# EAGLE design piZLC1 (EAGLE 9.6.2)
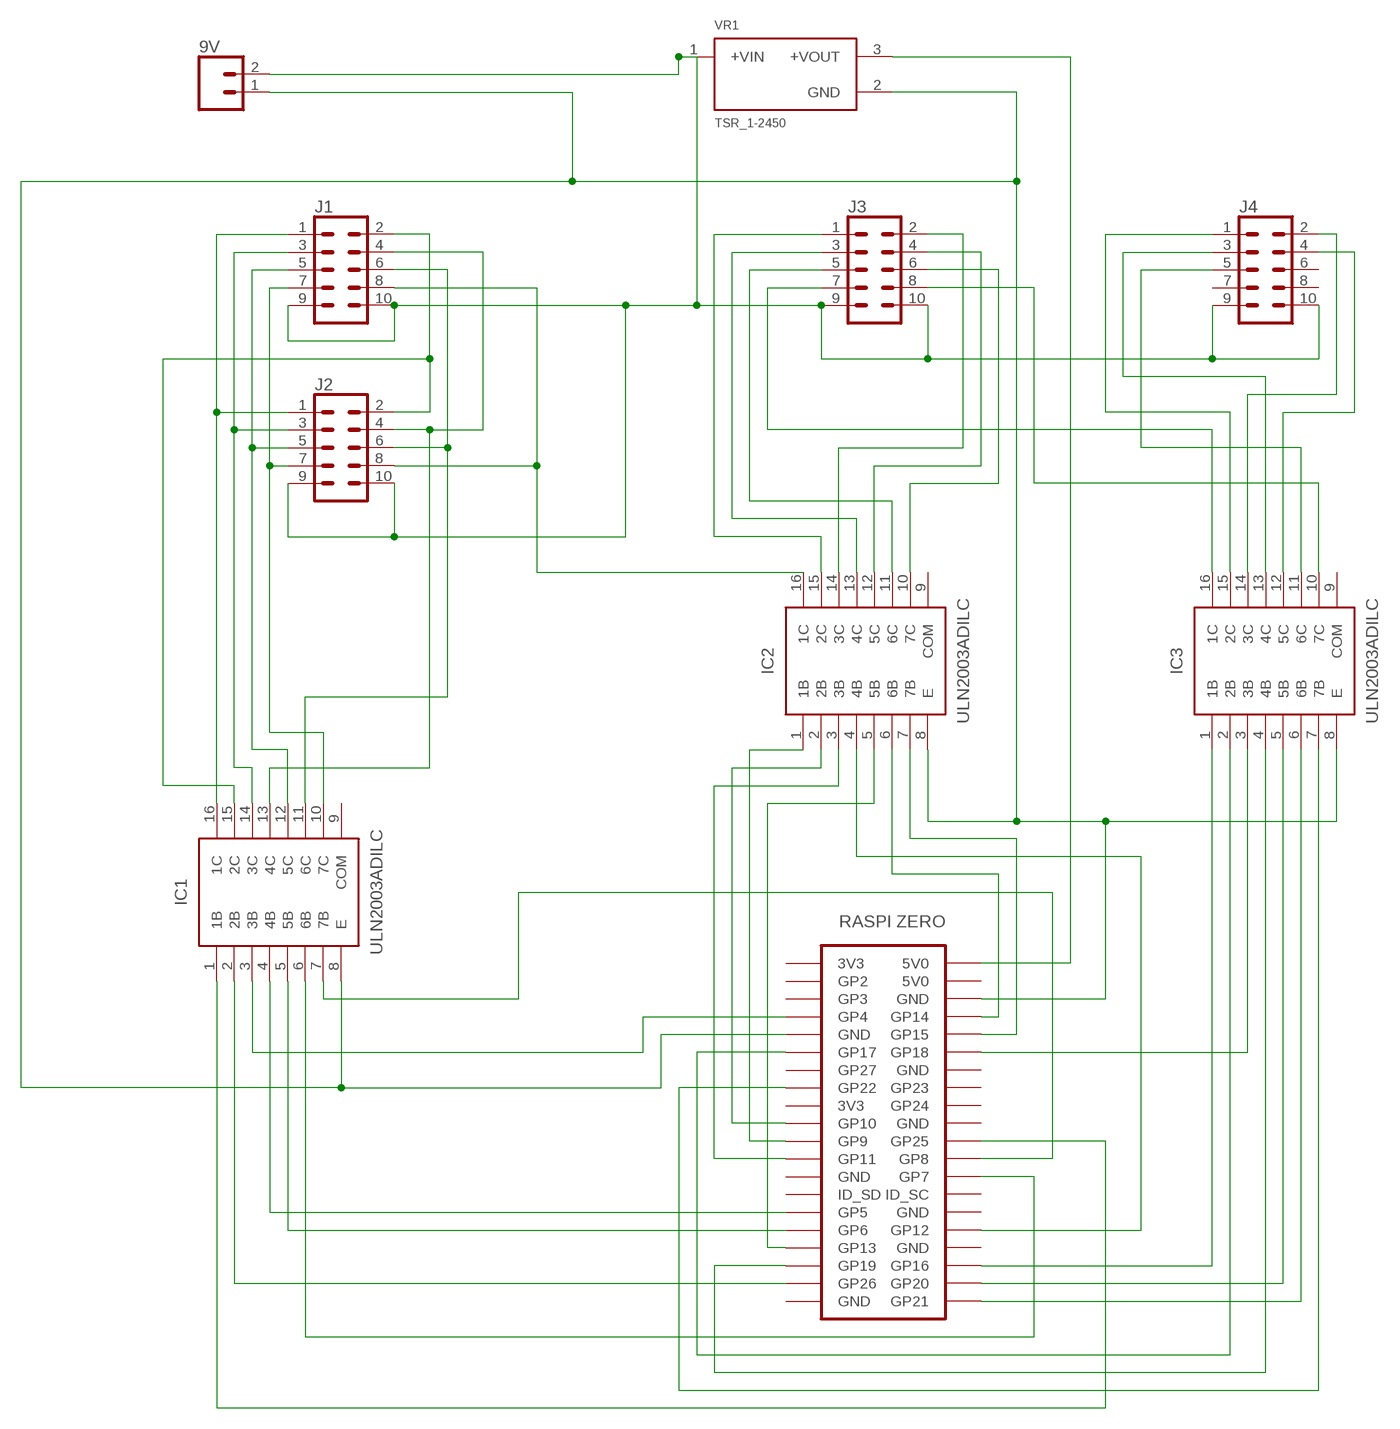
[diagram p0: schematic, sheet 1]

## Parts
9V  CONN_023.5MM  [SCREWTERMINAL-3.5MM-2]
IC1  ULN2003ADILC  [DIL16]
IC2  ULN2003ADILC  [DIL16]
IC3  ULN2003ADILC  [DIL16]
J1  CONN_05X2SHD  [2X5-SHROUDED]
J2  CONN_05X2SHD  [2X5-SHROUDED]
J3  CONN_05X2SHD  [2X5-SHROUDED]
J4  CONN_05X2SHD  [2X5-SHROUDED]
U$1  ZERO  [ZERO]
VR1  TSR_1-2450  [CONV_TSR_1-2450]

## Nets
N$1: U$1.4(5V0) VR1.3(+VOUT)
N$3: IC1.16(1C) J1.1 J2.1
N$4: IC1.14(3C) J1.3 J2.3
N$5: IC1.12(5C) J1.5 J2.5
N$6: IC1.10(7C) J1.7 J2.7
N$8: IC1.1(1B) U$1.22(GP25)
N$9: IC1.2(2B) U$1.37(GP26)
N$10: IC1.3(3B) U$1.7(GP4)
N$11: IC1.4(4B) U$1.29(GP5)
N$12: IC1.5(5B) U$1.31(GP6)
N$13: IC1.6(6B) U$1.26(GP7)
N$14: IC1.7(7B) U$1.24(GP8)
N$15: IC1.15(2C) J1.2 J2.2
N$16: 9V.1 IC1.8(E) IC2.8(E) IC3.8(E) U$1.6(GND) U$1.9(GND) VR1.2(GND)
N$17: IC1.13(4C) J1.4 J2.4
N$18: IC1.11(6C) J1.6 J2.6
N$19: IC2.16(1C) J1.8 J2.8
N$20: IC2.1(1B) U$1.21(GP9)
N$21: IC2.2(2B) U$1.19(GP10)
N$22: IC2.3(3B) U$1.23(GP11)
N$23: IC2.4(4B) U$1.32(GP12)
N$24: IC2.5(5B) U$1.33(GP13)
N$25: IC2.6(6B) U$1.8(GP14)
N$26: IC2.7(7B) U$1.10(GP15)
N$27: IC3.1(1B) U$1.36(GP16)
N$28: IC3.2(2B) U$1.11(GP17)
N$29: IC3.3(3B) U$1.12(GP18)
N$30: IC3.4(4B) U$1.35(GP19)
N$31: IC3.5(5B) U$1.38(GP20)
N$32: IC3.6(6B) U$1.40(GP21)
N$33: IC3.7(7B) U$1.15(GP22)
N$34: IC2.15(2C) J3.1
N$35: IC2.14(3C) J3.2
N$36: IC2.13(4C) J3.3
N$37: IC2.12(5C) J3.4
N$38: IC2.11(6C) J3.5
N$39: IC2.10(7C) J3.6
N$40: IC3.16(1C) J3.7
N$41: IC3.15(2C) J4.1
N$42: IC3.14(3C) J4.2
N$43: IC3.13(4C) J4.3
N$44: IC3.12(5C) J4.4
N$45: IC3.11(6C) J4.5
N$46: IC3.10(7C) J3.8
N$47: 9V.2 J1.9 J1.10 J2.9 J2.10 J3.9 J3.10 J4.9 J4.10 VR1.1(+VIN)
Unconnected: J4.6 J4.7 J4.8 U$1.1(3V3) U$1.2(5V0) U$1.3(GP2) U$1.5(GP3) U$1.13(GP27) U$1.14(GND) U$1.16(GP23) U$1.17(3V3) U$1.18(GP24) U$1.20(GND) U$1.25(GND) U$1.27(ID_SD) U$1.28(ID_SC) U$1.30(GND) U$1.34(GND) U$1.39(GND)

## Power pins joined to a net without a drawn wire
COM: IC1.9(COM) IC2.9(COM) IC3.9(COM)

## Library data of the parts
9V = SparkFun-Connectors:CONN_02: Multi connection point. Often used as Generic Header-pin footprint for 0.1 inch spaced/style header connections On any of the 0.1 inch spaced packages, you can populate with these: Break Away Headers - Straight <https://www.sparkfun.com/products/116> (PRT-00116) Break Away Male Headers - Right Angle <https://www.sparkfun.com/products/553> (PRT-00553) Female Headers <https://www.sparkfun.com/products/115> (PRT-00115) Break Away Headers - Machine Pin <https://www.sparkfun.com/products/117> (PRT-00117) Break Away Female Headers - Swiss Machine Pin <https://www.sparkfun.com/products/743> (PRT-00743) For SCREWTERMINALS and SPRING TERMINALS visit here: Screw Terimnals on SparkFun.com <https://www.sparkfun.com/search/results?term=Screw+Terminals> (5mm/3.5mm/2.54mm spacing) This device is also useful as a general connection point to wire up your design to another part of your project. Our various solder wires solder well into these plated through hole pads. Hook-Up Wire - Assortment (Stranded, 22 AWG) <https://www.sparkfun.com/products/11375> (PRT-11375) Hook-Up Wire - Assortment (Solid Core, 22 AWG) <https://www.sparkfun.com/products/11367> (PRT-11367) View the entire wire category on our website here <https://www.sparkfun.com/categories/141> Special notes: Molex polarized connector foot print use with: PRT-08233 with associated crimp pins and housings. 2.54_SCREWTERM for use with PRT-10571. 3.5mm Screw Terminal footprints for PRT-08084 5mm Screw Terminal footprints for use with PRT-08432; PROD_ID: CONN-08399
IC1-IC3 = TimsZero:ULN2003ADIL: High-Voltage, High-Current Darlington Transistor Arrays 500-mA Rated Collector Current(Single Output) High-Voltage Outputs: 50V Output Clamp Diodes
J1-J4 = SparkFun-Connectors:CONN_05X2: Multi connection point. Often used as Generic Header-pin footprint for 0.1 inch spaced/style header connections For AVR SPI programming port, see special device with nice symbol: "AVR_SPI_PROG_5x2.dev" You can populate with any combo of single row headers, but if you'd like an exact match, check these: 2x5 AVR ICSP Male Header <https://www.sparkfun.com/products/778> (PRT-00778) 2x5 Pin Shrouded Header <https://www.sparkfun.com/products/8506> (PRT-08506) On any of the 0.1 inch spaced packages, you can populate with these: Break Away Headers - Straight <https://www.sparkfun.com/products/116> (PRT-00116) Break Away Male Headers - Right Angle <https://www.sparkfun.com/products/553> (PRT-00553) Female Headers <https://www.sparkfun.com/products/115> (PRT-00115) Break Away Headers - Machine Pin <https://www.sparkfun.com/products/117> (PRT-00117) Break Away Female Headers - Swiss Machine Pin <https://www.sparkfun.com/products/743> (PRT-00743) Special note: the shrouded connector mates well with our 5x2 ribbon cables: 2x5 Pin IDC Ribbon Cable <https://www.sparkfun.com/products/8535> (PRT-08535); PROD_ID: CONN-08671; SF_ID: PRT-08506
U$1 = TimsZero:ZERO: Raspbery Pi Foundation Zero https://www.raspberrypi.org/products/pi-zero/
VR1 = TSR_1-2450:TSR_1-2450: Linear Regulator Replacement DC DC Converter 1 Output 12V 1A 15V - 36V Input; DESCRIPTION: Linear Regulator Replacement DC DC Converter 1 Output 5V 1A 6.5V - 36V Input; DIGI-KEY_PART_NUMBER: 1951-2524-ND; MF: Traco Power; MP: TSR 1-2450; PACKAGE: SIP-3 Tracopower

## Board
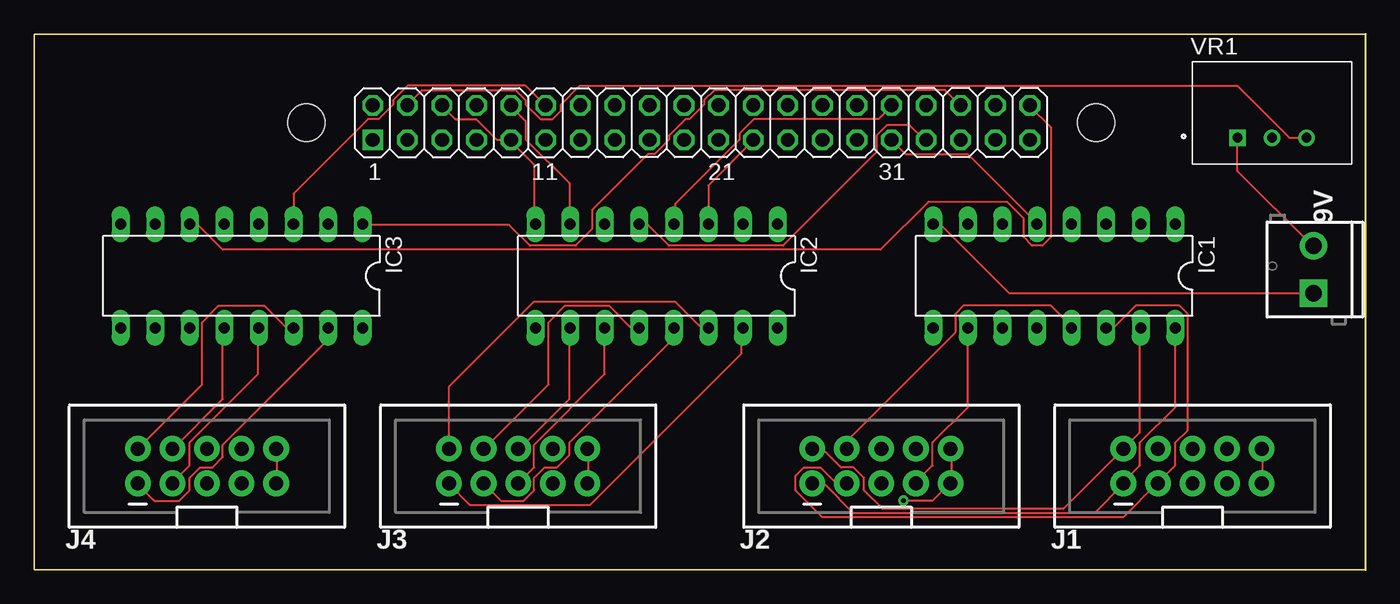
[diagram p1: board, top side]
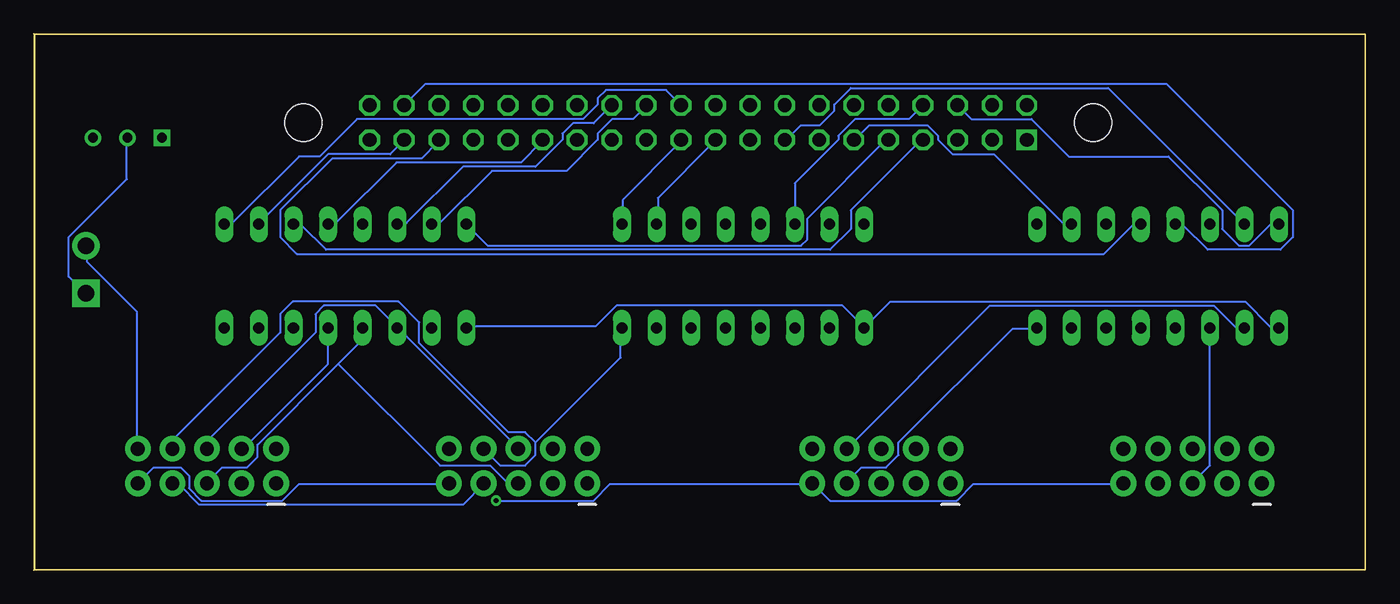
[diagram p2: board, bottom side, seen from below]

Size 97.79 x 39.37 mm. Coordinates in mm from the lower left corner, seen from the top.
Outline: 80.95,0 0,0 0,39.36 80.95,39.36
Outline: 97.79,39.37 97.79,0
Copper layers (1*16): Top 0.035mm / dielectric 1.5mm / Bottom 0.035mm
Design rules "default": minimum track width 6mil, minimum drill 0.35mm, track to track 6mil, track to pad 6mil, pad to pad 6mil, via to via 6mil, smd to smd 6mil, copper to edge 40mil, drill to drill 6mil, minimum pad ring 10mil, minimum via ring 8mil, stop-mask expansion 4mil, vias tented up to drill 0mil, thermal gap 10mil

### Footprints (pad centres in the part's own frame; a part is rotated, then mirrored left to right if it is on the bottom)
SCREWTERMINAL-3.5MM-2 = drill 1.2 pad 2.032 square: 1 0,0 | drill 1.2 pad 2.032: 2 3.5,0
DIL16 = drill 0.813 long: 1 -8.89,-3.81; 2 -6.35,-3.81; 3 -3.81,-3.81; 4 -1.27,-3.81; 5 1.27,-3.81; 6 3.81,-3.81; 7 6.35,-3.81; 8 8.89,-3.81; 9 8.89,3.81; 10 6.35,3.81; 11 3.81,3.81; 12 1.27,3.81; 13 -1.27,3.81; 14 -3.81,3.81; 15 -6.35,3.81; 16 -8.89,3.81
2X5-SHROUDED = drill 1.016 pad 1.88: 1 -1.27,5.08; 2 1.27,5.08; 3 -1.27,2.54; 4 1.27,2.54; 5 -1.27,0; 6 1.27,0; 7 -1.27,-2.54; 8 1.27,-2.54; 9 -1.27,-5.08; 10 1.27,-5.08
ZERO = drill 1.016 square: 1 8.37,25.24 | drill 1.016 octagon: 2 8.37,27.78; 3 10.91,25.24; 4 10.91,27.78; 5 13.45,25.24; 6 13.45,27.78; 7 15.99,25.24; 8 15.99,27.78; 9 18.53,25.24; 10 18.53,27.78; 11 21.07,25.24; 12 21.07,27.78; 13 23.61,25.24; 14 23.61,27.78; 15 26.15,25.24; 16 26.15,27.78; 17 28.69,25.24; 18 28.69,27.78; 19 31.23,25.24; 20 31.23,27.78; 21 33.77,25.24; 22 33.77,27.78; 23 36.31,25.24; 24 36.31,27.78; 25 38.85,25.24; 26 38.85,27.78; 27 41.39,25.24; 28 41.39,27.78; 29 43.93,25.24; 30 43.93,27.78; 31 46.47,25.24; 32 46.47,27.78; 33 49.01,25.24; 34 49.01,27.78; 35 51.55,25.24; 36 51.55,27.78; 37 54.09,25.24; 38 54.09,27.78; 39 56.63,25.24; 40 56.63,27.78 | hole 2.75: 3.5,26.5; 61.5,26.5
CONV_TSR_1-2450 = drill 0.71 pad 1.11 square: 1 -2.54,0 | drill 0.71 pad 1.11: 2 0,0; 3 2.54,0

### Placement (x,y rotation side)
9V  93.98,20.32 90 top
IC1  74.93,21.59 180 top
IC2  45.72,21.59 180 top
IC3  15.24,21.59 180 top
J1  85.09,7.62 90 top
J2  62.23,7.62 90 top
J3  35.56,7.62 90 top
J4  12.7,7.62 90 top
U$1  16.51,6.35 0 top
VR1  90.93,31.75 0 top

### Tracks (layer width: path | path; a pad name or v marks a point on that pad's centre or on a via)
COM
  Bottom 0.152: IC3.9 6.4,17.88 7.01,17.88 8.84,19.71 34.9,19.71 IC2.9 36.88,17.88 38.41,19.41 55.02,19.41 56.54,17.88 65.99,17.88 IC1.9
N$1
  Top 0.152: VR1.3 92.2,31.75 88.39,35.56 40.08,35.56 38.71,34.19 38.71,33.73 38.1,33.12 37.19,33.12 36.12,34.19 36.12,34.49 35.36,35.26 28.5,35.26 27.43,34.19 U$1.4
N$3
  Top 0.152: IC1.16 83.82,11.94 81.23,9.35 81.23,7.67 80.01,6.45 J1.1 80.01,6.3 77.88,4.17 60.2,4.17 58.06,6.3 57.15,6.3 J2.1
N$4
  Top 0.152: IC1.14 78.79,17.88 79.4,17.88 80.92,19.41 84.12,19.41 84.73,18.8 84.73,10.26 83.82,9.35 83.82,7.67 82.6,6.45 J1.3 82.45,6.3 80.01,3.86 57.91,3.86 55.93,5.84 55.93,6.91 56.54,7.52 57.76,7.52 58.83,6.45 59.59,6.45 J2.3
N$5
  Bottom 0.152: 75.44,15.14 81.38,9.19 81.38,8.28 82.14,7.52 83.97,7.52 85.04,6.45 J1.5 | 75.44,15.14 73.76,16.81 73.76,17.73 IC1.12 | 75.44,15.14 67.97,7.67 64.31,7.67 63.09,6.45 62.33,6.45 J2.5
N$6
  Top 0.152: IC1.10 68.58,11.94 65.99,9.35 65.99,7.67 64.77,6.45 J2.7
  Bottom 0.152: J1.7 87.63,6.3 87.17,6.3 85.65,4.78 66.29,4.78 64.77,6.3 J2.7
N$8
  Bottom 0.152: IC1.1 83.82,25.5 83.21,25.5 78.33,30.38 76.81,30.38 74.07,33.12 57.45,33.12 56.39,34.19 56.39,34.65 55.78,35.26 51.36,35.26 50.29,34.19 U$1.22
N$9
  Bottom 0.152: IC1.2 81.23,25.5 76.2,30.53 71.63,30.53 70.71,31.45 U$1.37
N$10
  Bottom 0.152: IC1.3 78.64,25.35 78.18,25.35 76.35,23.52 39.32,23.52 37.8,25.04 37.8,26.42 32.61,31.6 U$1.7
N$11
  Bottom 0.152: IC1.4 76.2,25.5 75.59,25.5 71.17,29.92 62.03,29.92 60.5,31.45 U$1.29
N$12
  Top 0.152: IC1.5 73.61,25.5 68.58,30.53 64.01,30.53 63.09,31.45 U$1.31
N$13
  Bottom 0.152: IC1.6 71.02,25.5 70.41,25.5 66.29,29.62 60.96,29.62 58.98,31.6 58.98,32.05 58.22,32.82 56.69,32.82 55.47,34.04 U$1.26
N$14
  Bottom 0.152: IC1.7 68.58,25.5 67.97,25.5 64.16,29.31 58.67,29.31 56.39,31.6 56.39,32.05 55.32,33.12 53.8,33.12 52.88,34.04 U$1.24
N$15
  Top 0.152: IC1.15 81.23,17.73 81.23,10.11 J1.2 75.59,4.47 62.33,4.47 60.96,5.84 60.96,6.76 60.2,7.52 59.28,7.52 57.91,8.89 J2.2
N$16
  Top 0.152: IC2.8 36.73,25.5 36.73,29.77 35.05,31.45 U$1.9 34.9,31.6 33.98,31.6 32.46,33.12 30.94,33.12 30.02,34.04 U$1.6 | 9V.1 71.63,20.32 66.6,25.35 66.14,25.35 IC1.8
  Bottom 0.152: IC3.8 6.4,25.35 7.01,25.35 8.53,23.83 9.3,23.83 10.52,25.04 10.52,26.42 14.48,30.38 21.79,30.38 24.54,33.12 28.96,33.12 29.87,34.04 U$1.6 | VR1.2 90.98,31.75 90.98,28.7 95.25,24.44 95.25,21.54 94.03,20.32 9V.1 | IC1.8 64.47,23.83 41.45,23.83 41,24.28 41,25.81 35.36,31.45 35.05,31.45 U$1.9
N$17
  Top 0.152: J2.4 59.74,8.89 59.74,9.5 67.67,17.42 67.67,18.8 68.28,19.41 74.68,19.41 76.2,17.88 IC1.13
  Bottom 0.152: IC1.13 76.2,15.14 82.45,8.89 J1.4
N$18
  Bottom 0.152: J2.6 62.18,8.89 71.02,17.73 IC1.11 71.17,17.88 72.69,19.41 76.5,19.41 77.11,18.8 77.11,17.42 85.04,9.5 85.04,8.89 J1.6
N$19
  Bottom 0.152: 60.96,9.35 54.71,15.6 54.71,17.73 IC2.16 | 60.96,9.35 60.96,8.43 61.72,7.67 63.55,7.67 J2.8 | J1.8 87.63,9.5 79.7,17.42 79.7,18.8 78.79,19.71 71.02,19.71 69.49,18.19 69.49,16.66 62.94,10.11 61.72,10.11 60.96,9.35
N$20
  Bottom 0.152: IC2.1 54.56,25.5 54.56,27.18 50.29,31.45 U$1.21
N$21
  Bottom 0.152: IC2.2 51.97,25.5 51.97,27.33 47.85,31.45 U$1.19
N$22
  Top 0.152: IC2.3 49.53,28.25 52.73,31.45 U$1.23
N$23
  Top 0.152: IC2.4 47.09,25.5 47.09,26.87 51.82,31.6 51.82,32.05 52.88,33.12 62.03,33.12 62.94,34.04 U$1.32
N$24
  Top 0.152: IC2.5 44.5,25.35 45.11,25.35 46.63,23.83 55.02,23.83 61.87,30.68 61.87,31.9 62.64,32.66 64.31,32.66 65.38,31.6 U$1.33
N$25
  Bottom 0.152: IC2.6 41.91,28.4 38.71,31.6 38.71,31.9 37.49,33.12 33.53,33.12 32.61,34.04 U$1.8
N$26
  Top 0.152: IC2.7 39.32,25.5 39.32,28.4 36.12,31.6 36.12,32.97 35.05,34.04 U$1.10
N$27
  Top 0.152: IC3.1 24.23,25.35 34.9,25.35 36.42,23.83 39.78,23.83 41,25.04 41,26.42 45.11,30.53 45.57,30.53 46.63,31.6 46.63,31.9 47.85,33.12 48.16,33.12 49.23,34.19 49.23,34.49 49.99,35.26 66.9,35.26 67.97,34.19 U$1.36
N$28
  Bottom 0.152: IC3.2 21.64,25.5 22.25,25.5 27.28,30.53 30.33,30.53 31.39,31.6 31.39,31.9 32.16,32.66 36.42,32.66 37.49,31.6 U$1.11
N$29
  Top 0.152: IC3.3 19.05,27.63 24.54,33.12 25.3,33.12 26.36,34.19 26.36,34.49 27.43,35.56 36.12,35.56 37.49,34.19 U$1.12
N$30
  Bottom 0.152: IC3.4 16.61,25.35 17.07,25.35 19.2,23.22 78.49,23.22 79.7,24.44 79.7,26.42 75.89,30.23 69.34,30.23 68.12,31.45 U$1.35
N$31
  Bottom 0.152: IC3.5 13.87,25.35 13.41,25.35 11.58,23.52 6.25,23.52 5.33,24.44 5.33,26.42 14.63,35.71 69.04,35.71 70.56,34.19 U$1.38
N$32
  Top 0.152: IC3.6 11.43,25.35 12.04,25.35 13.87,23.52 62.18,23.52 65.68,27.03 71.48,27.03 72.69,25.81 72.69,24.44 73.3,23.83 74.07,23.83 74.68,24.44 74.68,32.51 73.15,34.04 U$1.40
N$33
  Bottom 0.152: IC3.7 18.9,35.41 37.8,35.41 39.01,34.19 39.01,33.73 40.08,32.66 41.45,32.66 42.52,31.6 U$1.15
N$34
  Top 0.152: IC2.15 51.97,17.73 51.97,15.9 40.84,4.78 32,4.78 30.48,6.3 J3.1
N$35
  Top 0.152: J3.2 30.48,13.46 36.73,19.71 47.09,19.71 48.92,17.88 49.53,17.88 IC2.14
N$36
  Top 0.152: J3.3 34.29,5.08 35.97,5.08 36.73,5.84 36.73,6.76 37.49,7.52 38.41,7.52 39.32,8.43 39.32,9.35 46.94,16.97 46.94,17.73 IC2.13
N$37
  Top 0.152: IC2.12 44.35,17.88 43.74,17.88 42.22,19.41 39.01,19.41 37.8,18.19 37.8,13.61 33.07,8.89 J3.4
N$38
  Top 0.152: IC2.11 41.91,14.38 36.73,9.19 36.73,7.52 J3.5
N$39
  Top 0.152: IC2.10 39.32,17.73 39.32,12.55 35.66,8.89 J3.6
N$40
  Bottom 0.152: IC3.16 24.23,17.73 25.91,17.73 34.29,9.35 34.29,8.43 35.2,7.52 37.03,7.52 38.1,6.45 J3.7
N$41
  Top 0.152: IC3.15 21.49,17.73 21.49,16.81 13.87,9.19 13.87,8.28 13.11,7.52 12.19,7.52 11.43,6.76 11.43,5.84 10.67,5.08 8.84,5.08 7.62,6.3 J4.1
N$42
  Top 0.152: J4.2 12.34,13.61 12.34,18.19 13.56,19.41 16.92,19.41 18.44,17.88 19.05,17.88 IC3.14
N$43
  Top 0.152: IC3.13 16.46,17.73 16.46,14.38 11.43,9.35 11.43,7.67 10.21,6.45 J4.3
N$44
  Top 0.152: IC3.12 13.87,17.73 13.87,12.55 10.21,8.89 J4.4
N$45
  Bottom 0.152: IC3.11 11.43,7.67 12.65,6.45 J4.5
N$46
  Bottom 0.152: J3.8 27.58,19.41 11.12,19.41 9.6,17.88 8.99,17.88 IC3.10
N$47  (via drill 0.35)
  Top 0.152: J4.9 17.83,6.45 17.83,8.89 J4.10 | J3.9 40.69,6.45 40.69,8.89 J3.10 | VR1.1 88.39,29.31 93.88,23.83 9V.2 | J2.10 67.36,8.89 67.36,6.45 J2.9 67.21,6.3 65.99,5.08 v63.86,5.08 | J1.9 90.22,6.45 90.22,8.89 J1.10
  Bottom 0.152: J4.9 17.83,6.3 28.8,6.3 30.02,5.08 39.32,5.08 40.54,6.3 J3.9 40.69,6.3 55.47,6.3 56.69,5.08 v63.86,5.08 | J1.9 89,7.52 87.02,7.52 86.41,6.91 86.41,5.99 85.5,5.08 79.55,5.08 78.33,6.3 67.36,6.3 J2.9 | 9V.2 93.88,23.67 93.88,22.61 90.22,18.95 90.22,8.89 J1.10